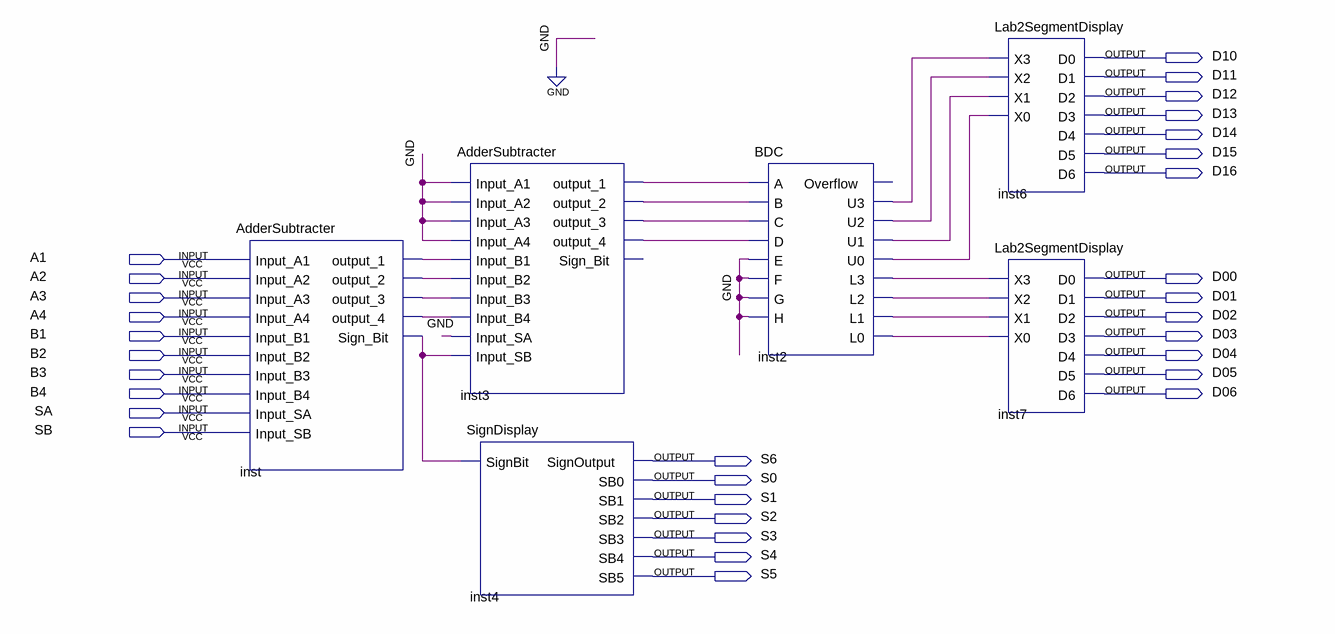
[diagram p0: schematic sheet]
// Quartus schematic AdderDisplay.bdf as structural Verilog: 6 symbols, 31 pins
module AdderDisplay (
  input  A1,
  input  A2,
  input  A3,
  input  A4,
  input  B1,
  input  B2,
  input  B3,
  input  B4,
  input  SA,
  input  SB,
  output D10,
  output D11,
  output D12,
  output D13,
  output D14,
  output D15,
  output D16,
  output D00,
  output D01,
  output D02,
  output D03,
  output D04,
  output D05,
  output D06,
  output S6,
  output S0,
  output S1,
  output S2,
  output S3,
  output S4,
  output S5
);

  wire inst2_l0, inst2_l1, inst2_l2, inst2_l3, inst2_u0, inst2_u1, inst2_u2, inst2_u3, inst3_output_1,
       inst3_output_2, inst3_output_3, inst3_output_4, inst_output_1, inst_output_2, inst_output_3,
       inst_output_4, inst_sign_bit;

  AdderSubtracter inst (
    .Input_A1(A1), .Input_A2(A2), .Input_A3(A3), .Input_A4(A4), .Input_B1(B1), .Input_B2(B2), .Input_B3(B3),
    .Input_B4(B4), .Input_SA(SA), .Input_SB(SB), .output_1(inst_output_1), .output_2(inst_output_2),
    .output_3(inst_output_3), .output_4(inst_output_4), .Sign_Bit(inst_sign_bit));
  AdderSubtracter inst3 (
    .Input_A1(1'b0), .Input_A2(1'b0), .Input_A3(1'b0), .Input_A4(1'b0), .Input_B1(inst_output_1),
    .Input_B2(inst_output_2), .Input_B3(inst_output_3), .Input_B4(inst_output_4), .Input_SA(1'b0),
    .Input_SB(inst_sign_bit), .output_1(inst3_output_1), .output_2(inst3_output_2),
    .output_3(inst3_output_3), .output_4(inst3_output_4));  // open: Sign_Bit
  SignDisplay inst4 (
    .SignBit(inst_sign_bit), .SignOutput(S6), .SB0(S0), .SB1(S1), .SB2(S2), .SB3(S3), .SB4(S4), .SB5(S5));
  BDC inst2 (
    .A(inst3_output_1), .B(inst3_output_2), .C(inst3_output_3), .D(inst3_output_4), .E(1'b0), .F(1'b0),
    .G(1'b0), .H(1'b0), .U3(inst2_u3), .U2(inst2_u2), .U1(inst2_u1), .U0(inst2_u0), .L3(inst2_l3),
    .L2(inst2_l2), .L1(inst2_l1), .L0(inst2_l0));  // open: Overflow
  Lab2SegmentDisplay inst6 (
    .X3(inst2_u3), .X2(inst2_u2), .X1(inst2_u1), .X0(inst2_u0), .D0(D10), .D1(D11), .D2(D12), .D3(D13),
    .D4(D14), .D5(D15), .D6(D16));
  Lab2SegmentDisplay inst7 (
    .X3(inst2_l3), .X2(inst2_l2), .X1(inst2_l1), .X0(inst2_l0), .D0(D00), .D1(D01), .D2(D02), .D3(D03),
    .D4(D04), .D5(D05), .D6(D06));
endmodule
